# Altium schematic sheet RTC.SchDoc
size A
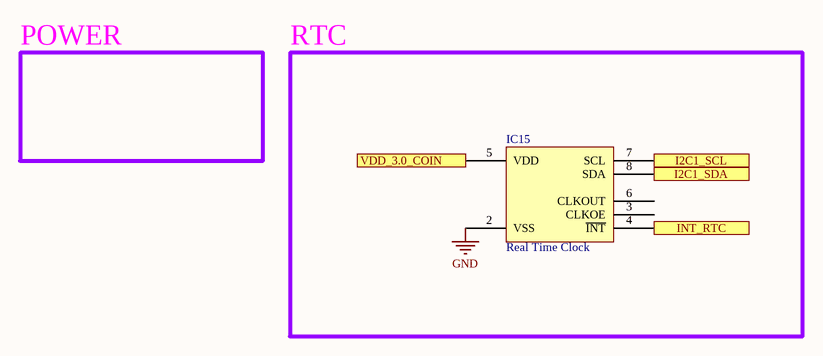
[diagram p0: RTC.SchDoc]

## Parts
IC15  Real Time Clock  [MICRO CRYSTAL 8-SON]

## Blocks framed on the sheet
RTC: IC15

## Ports
I2C1_SCL, I2C1_SDA, INT_RTC, VDD_3.0_COIN

## Nets
GND: IC15.2(VSS)
I2C1_SCL: IC15.7(SCL) ; port I2C1_SCL
I2C1_SDA: IC15.8(SDA) ; port I2C1_SDA
INT_RTC: IC15.4(~{INT}) ; port INT_RTC
VDD_3.0_COIN: IC15.5(VDD) ; port VDD_3.0_COIN

Not connected (* = marked no-connect by the designer): IC15 3(CLKOE) 6(CLKOUT)

## Notes on the sheet
- POWER

## Library data of the parts
IC15 = RTC00001: IC RTC CLK/CALENDAR I2C 8-SMT; Manufacturer: Micro Crystal AG; Manufacturer P/N: RV-8263-C7-32.768KHZ-20PPM-TA-QC; Time Format: HH:MM:SS; Date Format: YY-MM-DD-dd; Interface: I²C; Voltage - Supply: 0.9V ~ 5.5V; Current - Timekeeping Max: 240nA @ 3V; Device ID: RTC00001; Part Type: IC; VALUE: Real Time Clock; Package: 8-SON (3.2x1.5); Operating Temperature: -40°C ~ 85°C; Features: Alarm, Leap Year, RAM; Memory Size: -; Voltage - Supply Battery: -; Supplier1: Digi-Key; Supplier1 P/N: 2195-RV-8263-C7-32.768KHZ-20PPM-TA-QCCT-ND; Supplier2: Mouser; Supplier2 P/N: 428-8263C7328K20PTQC